# Altium schematic sheet SMA.SchDoc
size A4; SheetNumber: 5; SheetTotal: 6
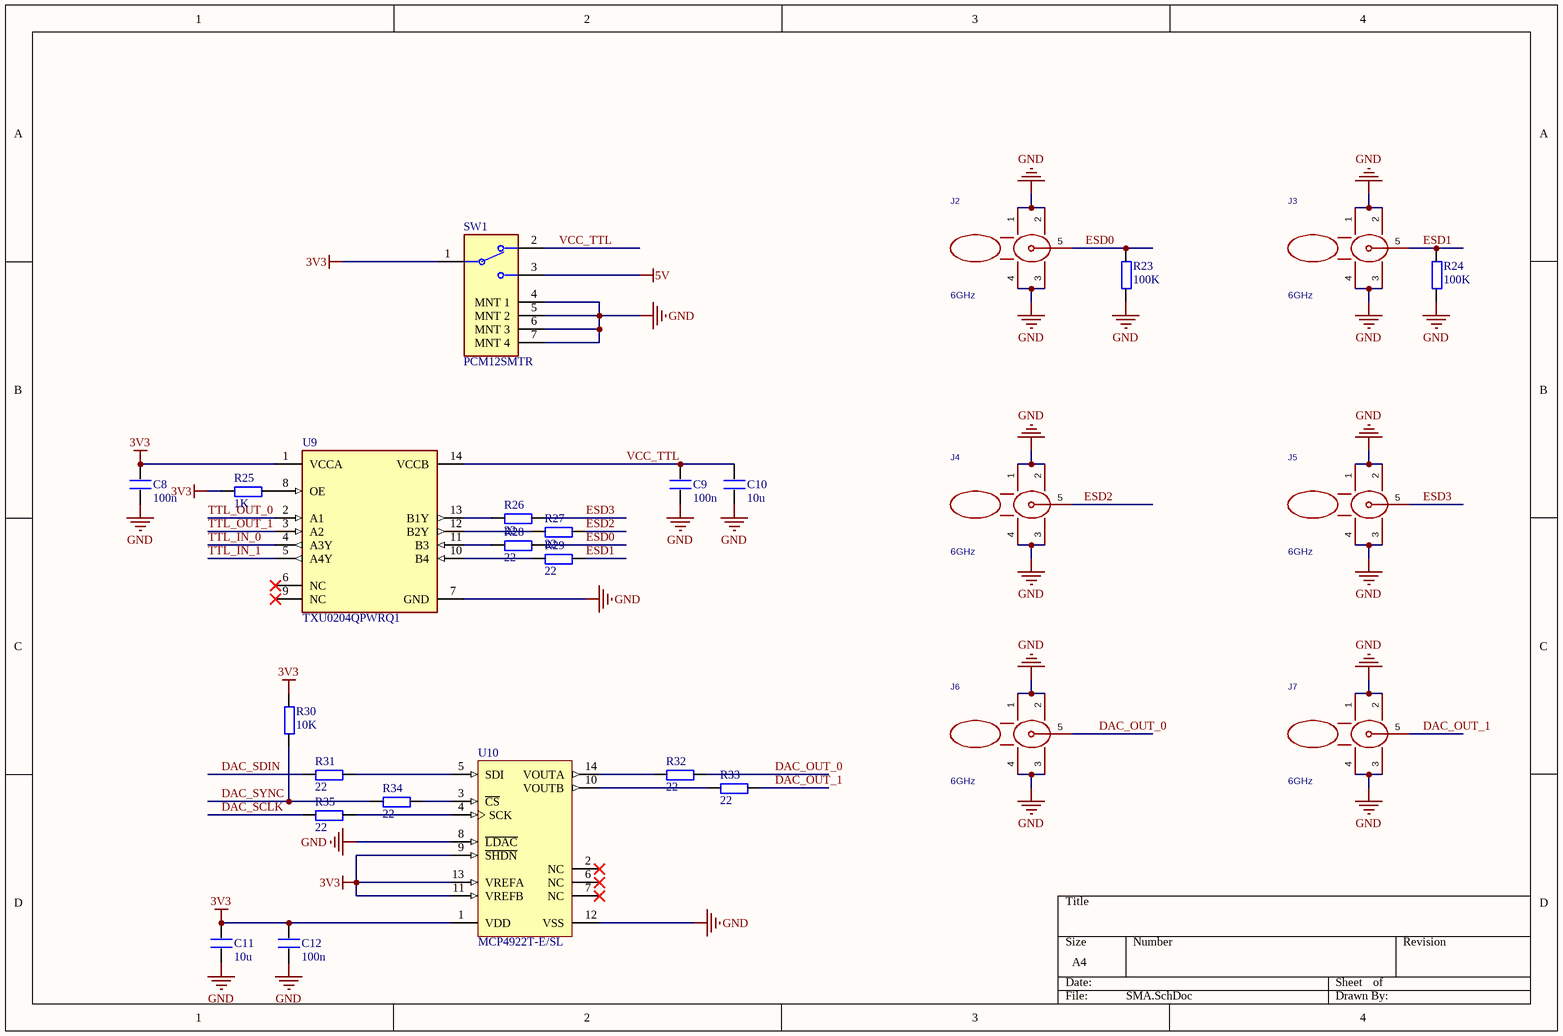
[diagram p0: SMA.SchDoc]

## Parts
C8  100n  [C 0402_L]
C9  100n  [C 0402_L]
C10  10u  [C 0603_L]
C11  10u  [C 0603_L]
C12  100n  [C 0402_L]
J2  6GHz  [PCBComponent_1 - duplicate2]
J3  6GHz  [PCBComponent_1 - duplicate2]
J4  6GHz  [PCBComponent_1 - duplicate2]
J5  6GHz  [PCBComponent_1 - duplicate2]
J6  6GHz  [PCBComponent_1 - duplicate2]
J7  6GHz  [PCBComponent_1 - duplicate2]
R23  100K  [R 0402_L]
R24  100K  [R 0402_L]
R25  1K  [R 0402_L]
R26  22  [R 0402_L]
R27  22  [R 0402_L]
R28  22  [R 0402_L]
R29  22  [R 0402_L]
R30  10K  [R 0402_L]
R31  22  [R 0402_L]
R32  22  [R 0402_L]
R33  22  [R 0402_L]
R34  22  [R 0402_L]
R35  22  [R 0402_L]
SW1  PCM12SMTR  [FP-PCM12SMTR-MFG]
U9  TXU0204QPWRQ1  [FP-PW0014A-MFG]
U10  MCP4922T-E/SL  [SOIC-SL14_M]

## Nets
3V3: C8.2 C11.2 C12.2 R25.1 R30.2 SW1.1 U9.1(VCCA) U10.1(VDD) U10.9(~{SHDN}) U10.11(VREFB) U10.13(VREFA)
5V: SW1.3
GND: C8.1 C9.1 C10.1 C11.1 C12.1 J2.1 J2.2 J2.3 J2.4 J3.1 J3.2 J3.3 J3.4 J4.1 J4.2 J4.3 J4.4 J5.1 J5.2 J5.3 J5.4 J6.1 J6.2 J6.3 J6.4 J7.1 J7.2 J7.3 J7.4 R23.1 R24.1 SW1.4(MNT_1) SW1.5(MNT_2) SW1.6(MNT_3) SW1.7(MNT_4) U9.7(GND) U10.8(~{LDAC}) U10.12(VSS)
DAC_OUT_0: J6.5 R32.2
DAC_OUT_1: J7.5 R33.2
DAC_SCLK: R35.1
DAC_SDIN: R31.1
DAC_SYNC: R30.1 R34.1
ESD0: J2.5 R23.2 R28.2
ESD1: J3.5 R24.2 R29.2
ESD2: J4.5 R27.2
ESD3: J5.5 R26.2
TTL_IN_0: U9.4(A3Y)
TTL_IN_1: U9.5(A4Y)
TTL_OUT_0: U9.2(A1)
TTL_OUT_1: U9.3(A2)
VCC_TTL: C9.2 C10.2 SW1.2 U9.14(VCCB)
NetR25_2: R25.2 U9.8(OE)
NetR26_1: R26.1 U9.13(B1Y)
NetR27_1: R27.1 U9.12(B2Y)
NetR28_1: R28.1 U9.11(B3)
NetR29_1: R29.1 U9.10(B4)
NetR31_2: R31.2 U10.5(SDI)
NetR32_1: R32.1 U10.14(VOUTA)
NetR33_1: R33.1 U10.10(VOUTB)
NetR34_2: R34.2 U10.3(~{CS})
NetR35_2: R35.2 U10.4(SCK)

Not connected (* = marked no-connect by the designer): U9 6(NC)* 9(NC)*; U10 2(NC)* 6(NC)* 7(NC)*

## Library data of the parts
C8-C12 = C_1
J2-J7 = BWSMA-KE-Z001_C496549: Connector Type:Board Side Interface:Inner Bore Number of Ports:1 Interface Diameter:6.2mm Interface Length/Height:- Frequency:6GHz RF Series:SMA Impedance:50Ω Style:Positive Pin Operating Temperature Range:-65℃~+165℃ Operating Temperature Range:-65℃~+165℃; Manufacturer: BAT WIRELESS(蝙蝠无线); AddInBom: yes; ModelId: f6f48ffe9da340b09a5b7cf26dc9292d聨0819f05c4eef4c71ace90d822a990e87; ModelName: SMA-TH_5P-L6.5-W6.5-H9.8_BWSMA-KE-Z001; ModelTransform: 255.905,255.905,0,0,0,0,0,0,-137.795; Number of Ports: 1; Interface Diameter: 6.2mm; RF Series: SMA; Impedance: 50Ω; Symbol: BWSMA-KE-Z001; Device: BWSMA-KE-Z001_C496549; Supplier: LCSC; Supplier Part: C496549; Manufacturer Part: BWSMA-KE-Z001; JLCPCB Part Class: Extended Part; LCSC Part Name: 内孔 SMA 正脚; Supplier Footprint: 插件; Datasheet: https://item.szlcsc.com/datasheet/BWSMA-KE-Z001/508498.html; ConvertToPcb: yes; FootprintName: SMA-TH_BWSMA-KE-Z001; Connector Type: Board Side; Interface: Inner Bore; Interface Length/Height: -; Value: 6GHz; Style: Positive Pin; Operating Temperature Range: -65℃~+165℃
R23-R35 = R
SW1 = CMP-2000-06884-2: SWITCH SLIDE SPDT 300MA 6V; Actuator Material: Nylon; Switch Function: On-On; Insulation Resistance: 100mR; Actuator Type: Standard; Mechanical Life: 10000Cycles; Actuator Length: 1.5mm; Contact Resistance: 70mR; Min Operating Temperature: -20°C; Max Current Rating: 300mA; Max Voltage Rating (DC): 6V; Package Quantity: 1; Mount: Surface Mount; Packaging: Tape and Reel; Contact Plating: Silver; Depth: 5mm; REACH SVHC: No SVHC; Voltage Rating (DC): 6V; Voltage Rating (AC): 6V; Max Operating Temperature: 85°C; Length: 7.7mm; Termination: Gull Wing; Current Rating: 300mA; Contact Current Rating: 300mA; Orientation: Right Angle; Width: 6.7mm; Switch Travel: 1.5mm; Lead Free: Lead Free; Contact Material: Copper Alloy; Throw Configuration: SPDT
U9 = CMP-00370-119764918-1: TXU0204QPWRQ1 Automotive four-channel fixed multidirectional level shifter 14-TSSOP -40 to 125; Manufacturer Lifecycle Status: ACTIVE; Number of Bits: 4; Data Rate: 200Mbps; Propagation Delay: 8ns; Number of Circuits: 1; Nominal Supply Current: 2.5µA; Max Junction Temperature (Tj): 150°C; Case/Package: TSSOP; Length: 5mm; Min Operating Temperature: -40°C; Width: 4.4mm; Number of Inputs: 4; NexarPartId: 119764918; Max Operating Temperature: 125°C; Number of Pins: 14; Lifecycle Status: Production; Number of Outputs: 4; Thickness: 1mm; Ambient Temperature Range High: 125°C; Height: 1.2mm
U10 = CMP-0188-00479-2: 12-Bit DAC with SPI Interface, 14-Pin SOIC 150mil, Extended Temperature, Tape and Reel; ComponentLink2URL: http://ww1.microchip.com/downloads/en/DeviceDoc/22250A.pdf; PackageReference: SOIC-SL14; ComponentLink1URL: http://www.microchip.com/; ComponentLink2Description: Datasheet; RevisionNote: URLs added. DatasheetVersion updated. Sch updated.; ComponentLink3URL: http://www.microchip.com/stellent/groups/techpub_sg/documents/packagingspec/en012702.pdf; PackageVersion: revBB, Aug-2009; ComponentLink1Description: Manufacturer URL; ComponentLink3Description: Package Specification; PackageDescription: 14-Lead Plastic Small Outline (SL) - Narrow, 3.90mm Body [SOIC]; Code_JEDEC: MS-012-AB; Code_IPC: SOIC127P600-14; DatasheetVersion: revA, Apr-2010